# EAGLE design STM_Central_Circuit (EAGLE 6.5.0)
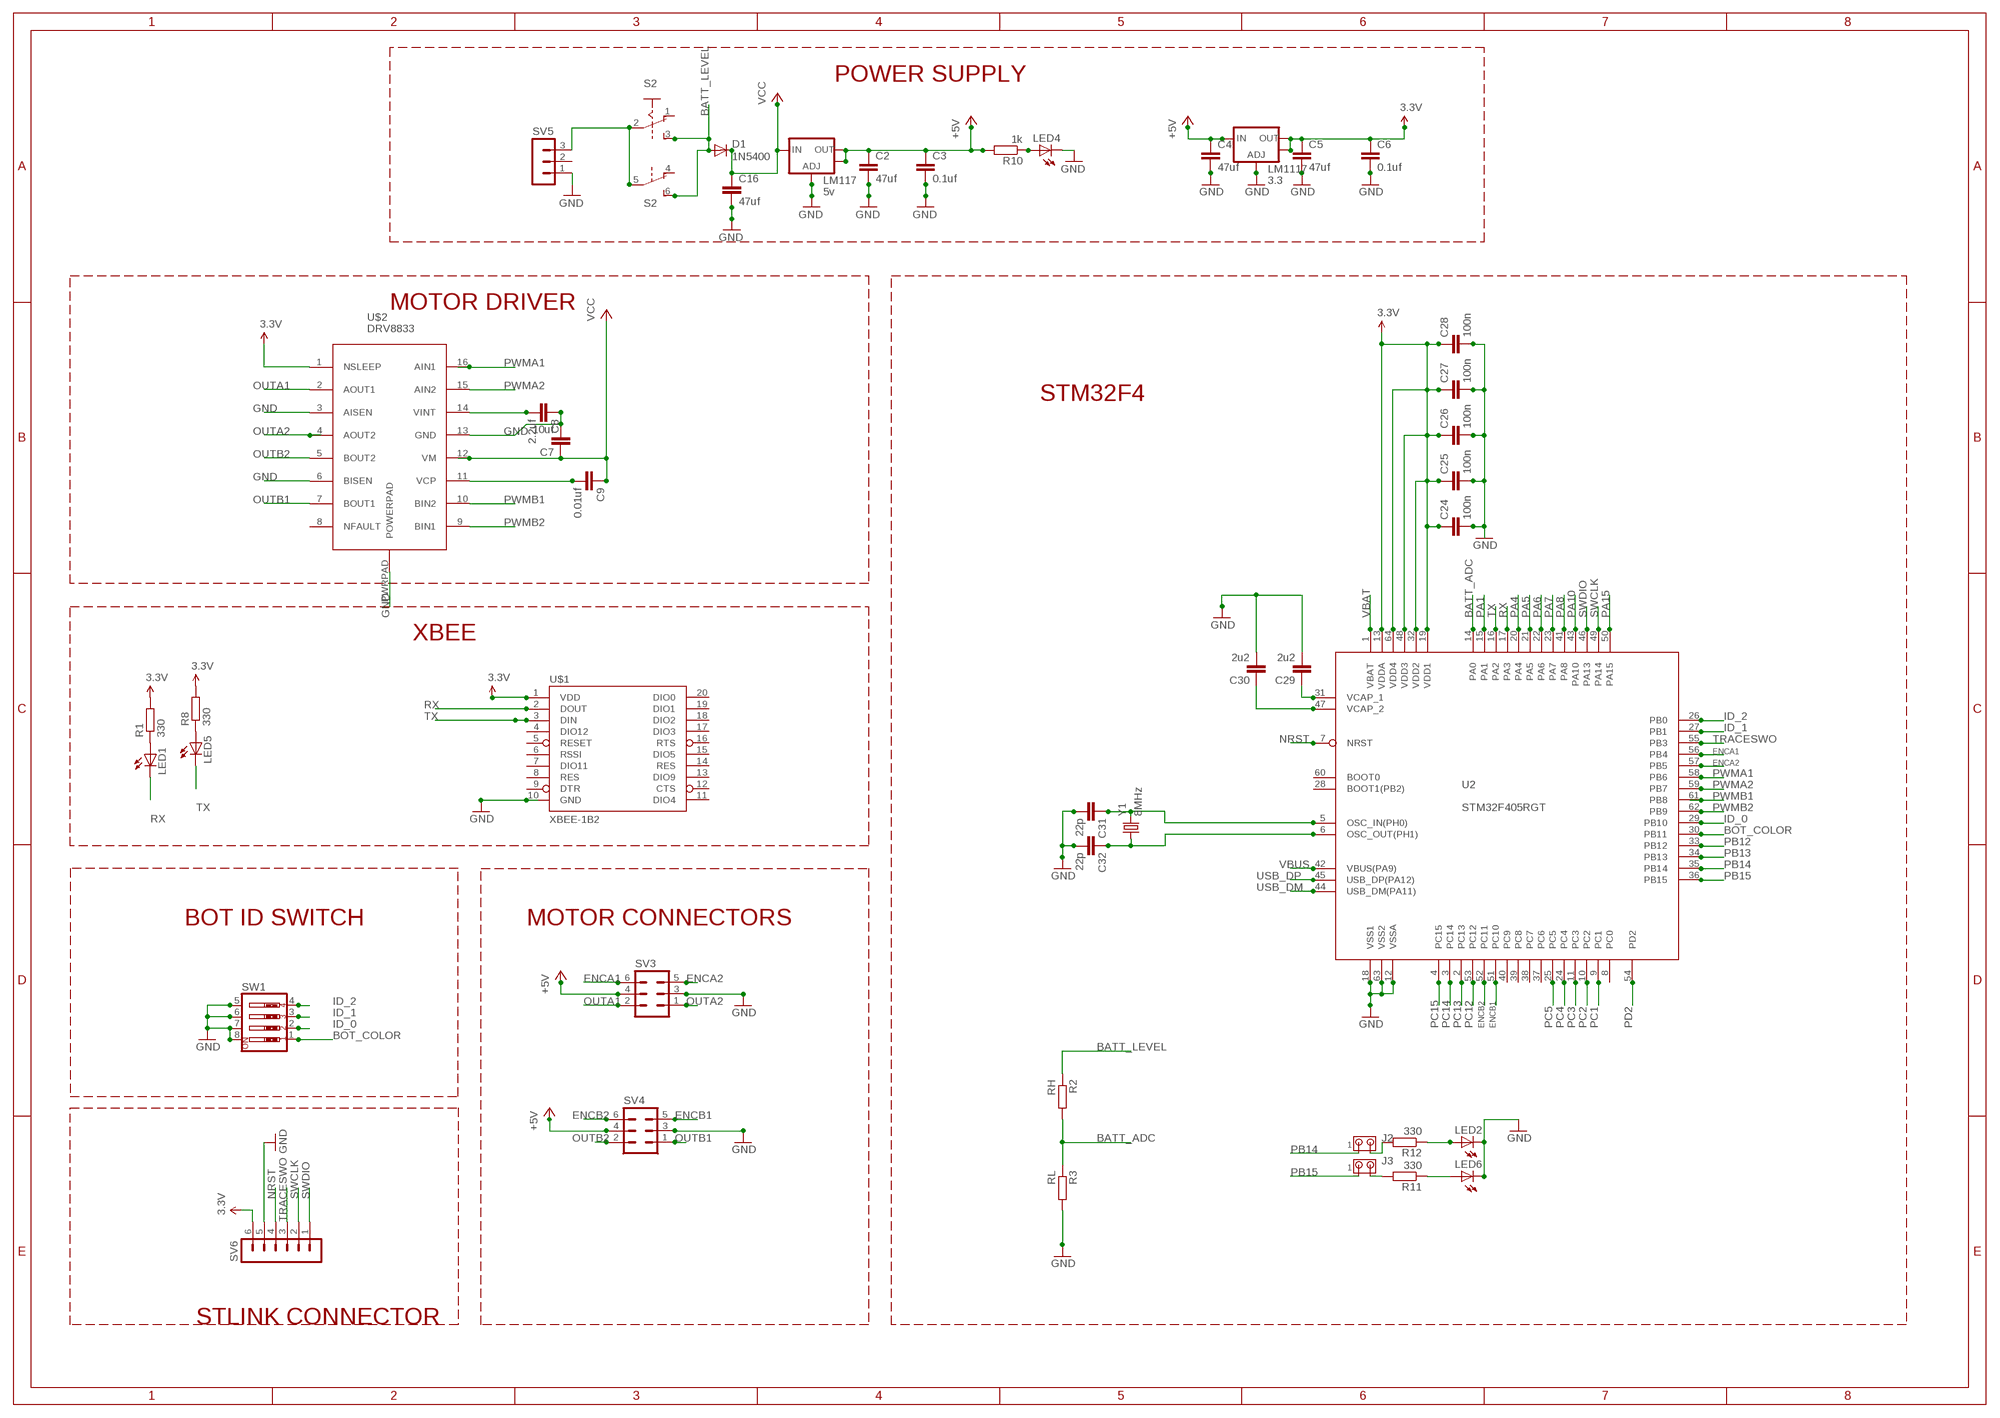
[diagram p0: schematic, sheet 1]

## Parts
C2  47uf  C-EUC1206  [C1206]
C3  0.1uf  C-EUC1206  [C1206]
C4  47uf  C-EUC1206  [C1206]
C5  47uf  C-EUC1206  [C1206]
C6  0.1uf  C-EUC1206  [C1206]
C7  10uf  C-EUC1206  [C1206]
C8  2.2uf  C-EUC1206  [C1206]
C9  0.01uf  C-EUC1206  [C1206]
C16  47uf  C-EUC1206  [C1206]
C24  100n  CAP0603-CAP  [0603-CAP]
C25  100n  CAP0603-CAP  [0603-CAP]
C26  100n  CAP0603-CAP  [0603-CAP]
C27  100n  CAP0603-CAP  [0603-CAP]
C28  100n  CAP0603-CAP  [0603-CAP]
C29  2u2  CAP0603-CAP  [0603-CAP]
C30  2u2  CAP0603-CAP  [0603-CAP]
C31  22p  CAP0603-CAP  [0603-CAP]
C32  22p  CAP0603-CAP  [0603-CAP]
D1  1N5400  [DO201-15]
J2  MTA02-100  [10X02MTA]
J3  MTA02-100  [10X02MTA]
LED1  LED5MM  [LED5MM]
LED2  LED5MM  [LED5MM]
LED4  LED5MM  [LED5MM]
LED5  LED5MM  [LED5MM]
LED6  LED5MM  [LED5MM]
LM117  5v  V_REG_LM1117SOT223  [SOT223]
LM1117  3.3  V_REG_LM1117SOT223  [SOT223]
R1  330  R-EU_0207/10  [0207/10]
R2  RH  R-EU_0207/10  [0207/10]
R3  RL  R-EU_0207/10  [0207/10]
R8  330  R-EU_0207/10  [0207/10]
R10  1k  R-EU_0207/10  [0207/10]
R11  330  R-EU_0207/10  [0207/10]
R12  330  R-EU_0207/10  [0207/10]
S2  A68-A31  [A68-A31]
SV3  MA03-2  [MA03-2]
SV4  MA03-2  [MA03-2]
SV5  MA03-1  [MA03-1]
SV6  MA06-1  [MA06-1]
SW1  SW_DIP-4  [EDG-04]
U2  STM32F405RGT  [LQFP64]
U$1  XBEE-1B2  [XBEE-SILK]
U$2  DRV8833  [PWP_R_PDSO_G16]
Y1  8MHz  CRYSTAL5X3  [CRYSTAL-SMD-5X3]

## Nets
3.3V: C5.1 C6.1 C24.1 C25.1 C26.1 C27.1 C28.1 LM1117.2(OUT) LM1117.4(OUT) R1.2 R8.2 SV6.6 U2.13(VDDA) U2.19(VDD1) U2.32(VDD2) U2.48(VDD3) U2.64(VDD4) U$1.1(VDD) U$2.1(NSLEEP)
+5V: C2.1 C3.1 C4.1 LM117.2(OUT) LM117.4(OUT) LM1117.3(IN) R10.2 SV3.4 SV4.4
BATT_ADC: R2.2 R3.1 U2.14(PA0)
BATT_LEVEL: D1.A R2.1 S2.3(A:S) S2.6(B:S)
BOT_COLOR: SW1.1 U2.30(PB11)
ENCA1: SV3.6 U2.56(PB4)
ENCA2: SV3.5 U2.57(PB5)
ENCB1: SV4.5 U2.51(PC10)
ENCB2: SV4.6 U2.52(PC11)
GND: C2.2 C3.2 C4.2 C5.2 C6.2 C7.2 C8.1 C16.2 C24.2 C25.2 C26.2 C27.2 C28.2 C29.2 C30.2 C31.2 C32.2 LED2.K(C) LED4.K(C) LED6.K(C) LM117.1(ADJ) LM1117.1(ADJ) R3.2 SV3.3 SV4.3 SV5.1 SV6.5 SW1.5 SW1.6 SW1.7 SW1.8 U2.12(VSSA) U2.18(VSS1) U2.63(VSS2) U$1.10(GND) U$2.3(AISEN) U$2.6(BISEN) U$2.13(GND) U$2.PWRPAD(POWERPAD)
ID_0: SW1.2 U2.29(PB10)
ID_1: SW1.3 U2.27(PB1)
ID_2: SW1.4 U2.26(PB0)
N$1: LED1.A R1.1
N$2: LED6.A R11.1
N$3: J2.2 R12.2
N$4: LED4.A R10.1
N$6: LED5.A R8.1
N$7: C8.2 U$2.14(VINT)
N$8: J3.2 R11.2
N$9: LED2.A R12.1
N$10: S2.2(A:P) S2.5(B:P) SV5.3
N$11: C9.2 U$2.11(VCP)
N$13: C29.1 U2.31(VCAP_1)
N$14: C30.1 U2.47(VCAP_2)
N$19: C32.1 U2.6(OSC_OUT(PH1)) Y1.1
N$24: C31.1 U2.5(OSC_IN(PH0)) Y1.3
NRST: SV6.4 U2.7(NRST)
OUTA1: SV3.2 U$2.2(AOUT1)
OUTA2: SV3.1 U$2.4(AOUT2)
OUTB1: SV4.1 U$2.7(BOUT1)
OUTB2: SV4.2 U$2.5(BOUT2)
PA1: U2.15(PA1)
PA4: U2.20(PA4)
PA5: U2.21(PA5)
PA6: U2.22(PA6)
PA7: U2.23(PA7)
PA8: U2.41(PA8)
PA10: U2.43(PA10)
PA15: U2.50(PA15)
PB12: U2.33(PB12)
PB13: U2.34(PB13)
PB14: J2.1 U2.35(PB14)
PB15: J3.1 U2.36(PB15)
PC1: U2.9(PC1)
PC2: U2.10(PC2)
PC3: U2.11(PC3)
PC4: U2.24(PC4)
PC5: U2.25(PC5)
PC12: U2.53(PC12)
PC13: U2.2(PC13)
PC14: U2.3(PC14)
PC15: U2.4(PC15)
PD2: U2.54(PD2)
PWMA1: U2.58(PB6) U$2.16(AIN1)
PWMA2: U2.59(PB7) U$2.15(AIN2)
PWMB1: U2.61(PB8) U$2.10(BIN2)
PWMB2: U2.62(PB9) U$2.9(BIN1)
RX: LED1.K(C) U2.17(PA3) U$1.2(DOUT)
SWCLK: SV6.2 U2.49(PA14)
SWDIO: SV6.1 U2.46(PA13)
TRACESWO: SV6.3 U2.55(PB3)
TX: LED5.K(C) U2.16(PA2) U$1.3(DIN)
USB_DM: U2.44(USB_DM(PA11))
USB_DP: U2.45(USB_DP(PA12))
VBAT: U2.1(VBAT)
VBUS: U2.42(VBUS(PA9))
VCC: C7.1 C9.1 C16.1 D1.C LM117.3(IN) U$2.12(VM)
Unconnected: S2.1(A:O) S2.4(B:O) SV5.2 U2.8(PC0) U2.28(BOOT1(PB2)) U2.37(PC6) U2.38(PC7) U2.39(PC8) U2.40(PC9) U2.60(BOOT0) U$1.4(DIO12) U$1.5(RESET) U$1.6(RSSI) U$1.7(DIO11) U$1.8(RES) U$1.9(DTR) U$1.11(DIO4) U$1.12(CTS) U$1.13(DIO9) U$1.14(RES) U$1.15(DIO5) U$1.16(RTS) U$1.17(DIO3) U$1.18(DIO2) U$1.19(DIO1) U$1.20(DIO0) U$2.8(NFAULT)

## Notes on the sheet
- POWER SUPPLY
- MOTOR DRIVER
- STM32F4
- XBEE
- BOT ID SWITCH | MOTOR CONNECTORS
- STLINK CONNECTOR

## Library data of the parts
C2-C9 C16 = rcl:C-EU: CAPACITOR, European symbol
C24-C32 = stm32f4stamp:CAP: Capacitor Standard 0603 ceramic capacitor, and 0.1" leaded capacitor.
D1 = diode:1N5400: DIODE standard rectifier, 3 A, 50 V (Motorola)
J2 J3 = con-amp:MTA02-100: AMP connector; OC_FARNELL: unknown; OC_NEWARK: unknown
LED1 LED2 LED4-LED6 = SparkFun:LED: LEDs Standard schematic elements and footprints for 5mm, 3mm, 1206, and 0603 sized LEDs. 5mm - Spark Fun Electronics SKU : COM-00529 (and others)
LM117 LM1117 = SparkFun:V_REG_LM1117: Voltage Regulator LM1117 Standard adjustable voltage regulator but in SMD form. Spark Fun Electronics SKU : COM-00595
R1-R3 R8 R10-R12 = rcl:R-EU_: RESISTOR, European symbol
S2 = switch:A68-A31: SLIDING SWITCH Siemens, distributor Buerklin, 11G766
SV3 SV4 = con-lstb:MA03-2: PIN HEADER; OC_FARNELL: unknown; OC_NEWARK: unknown
SV5 = con-lstb:MA03-1: PIN HEADER; OC_FARNELL: unknown; OC_NEWARK: unknown
SV6 = con-lstb:MA06-1: PIN HEADER; OC_FARNELL: unknown; OC_NEWARK: unknown
SW1 = special:SW_DIP-4: DIP SWITCH
U2 = stm32f4stamp:STM32F405RGT
U$1 = SparkFun:XBEE-1
U$2 = drv8833:DRV8833
Y1 = stm32f4stamp:CRYSTAL: Crystals Various standard crystals. Proven footprints. Spark Fun Electronics SKU : COM-00534

## Net classes
1 pwr: width 0.25 mm

## Board
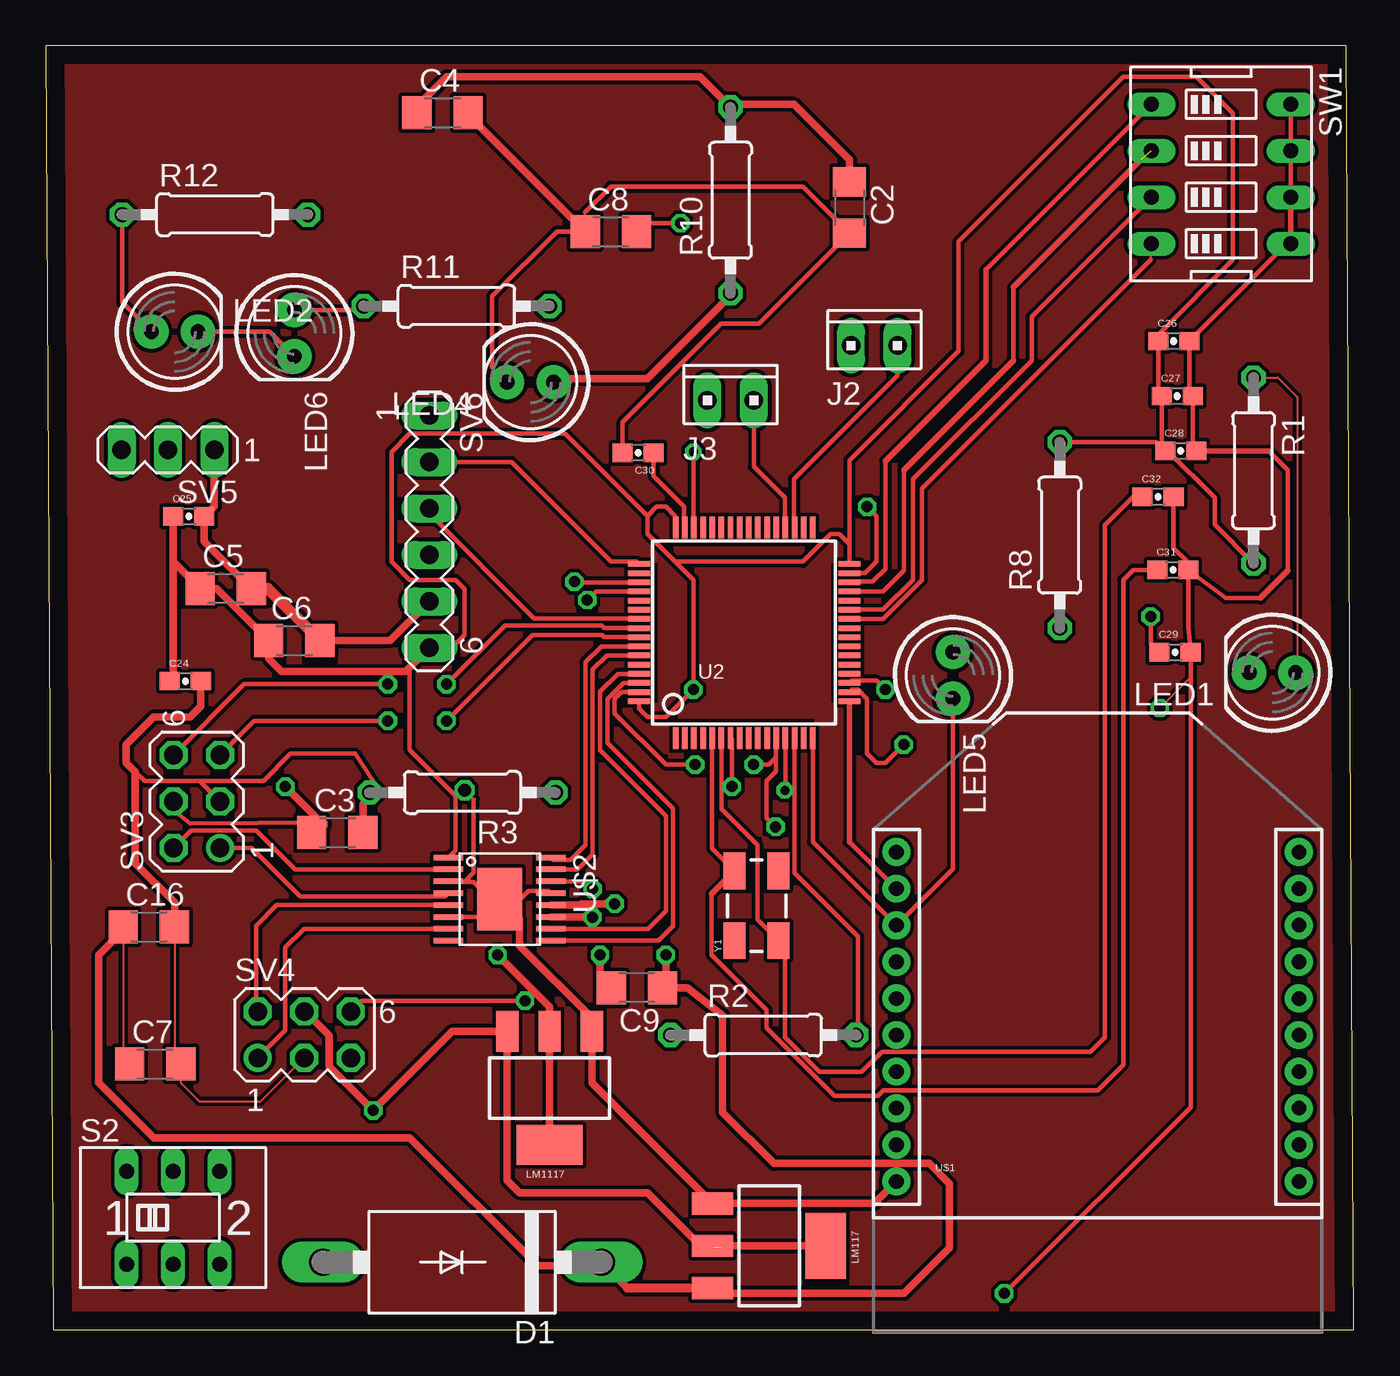
[diagram p1: board, top side]
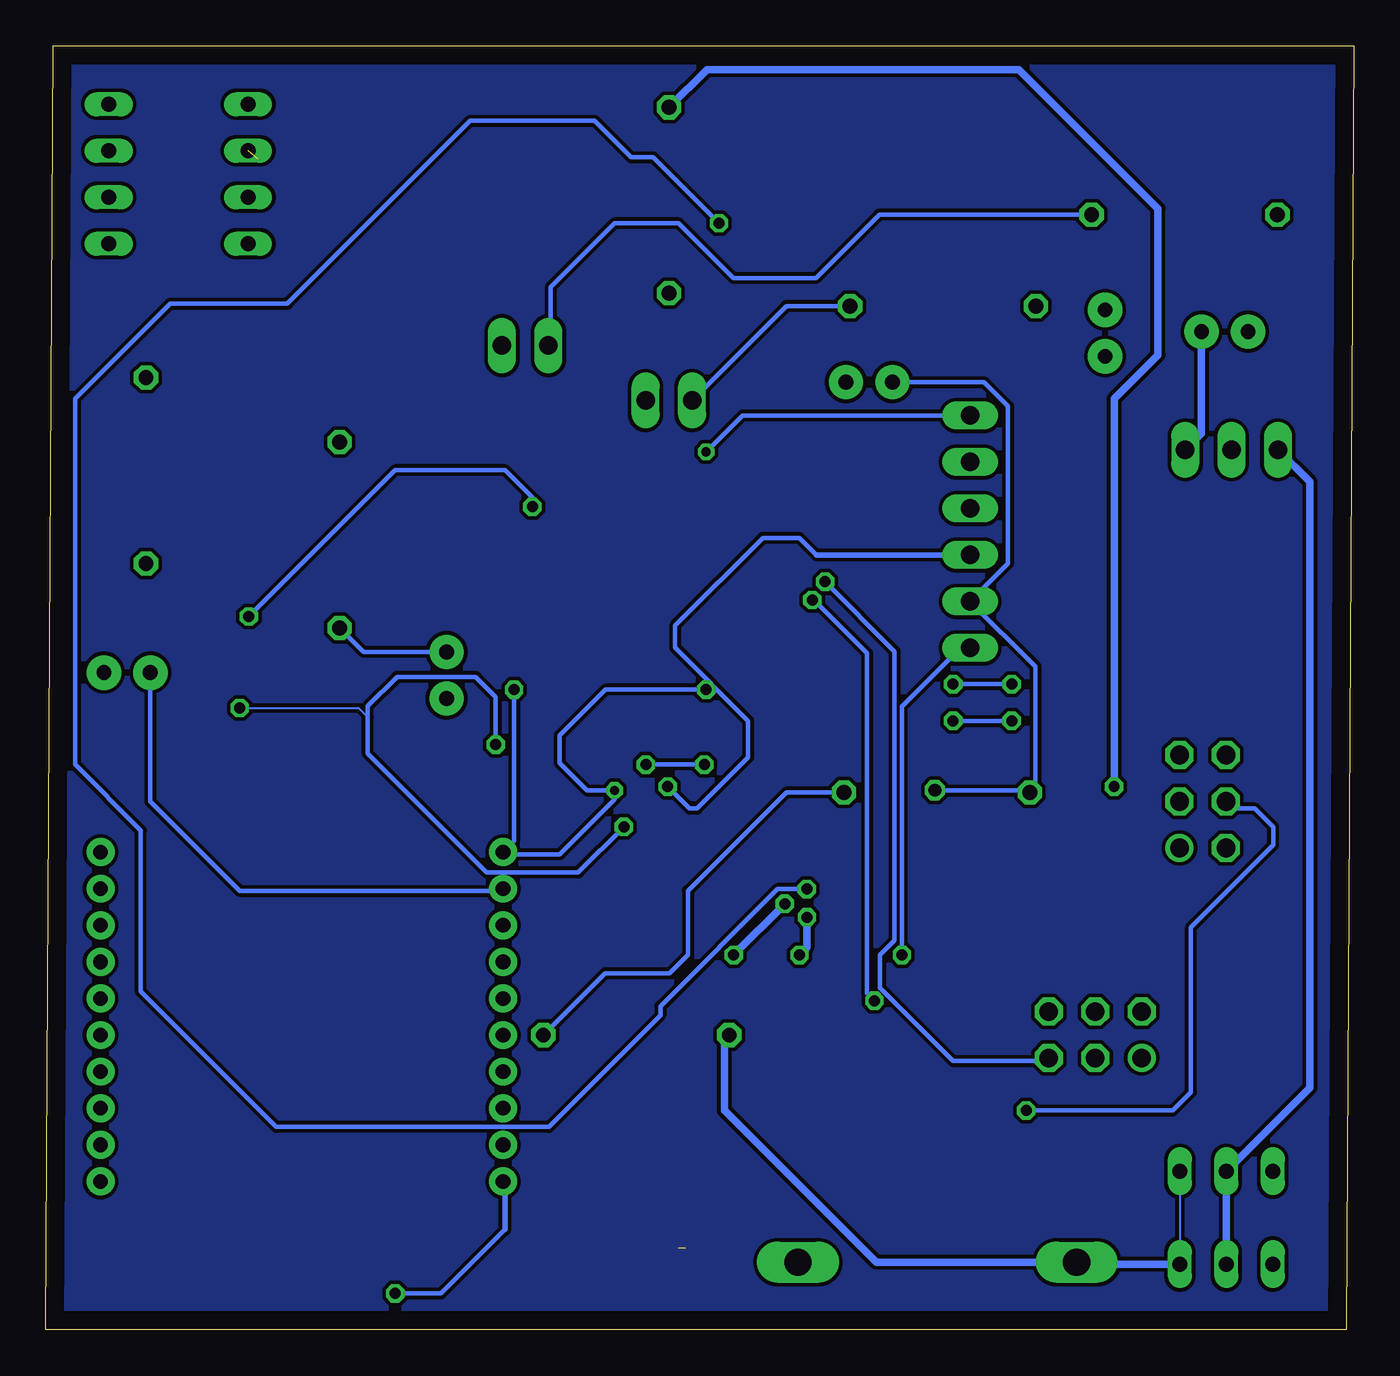
[diagram p2: board, bottom side, seen from below]

Size 71.5 x 70.2 mm. Coordinates in mm from the lower left corner, seen from the top.
Outline: 0.4,0 71.5,0 71.1,70.2 0,70.2 0.4,0
Copper layers (1*16): Top 0.035mm / dielectric 1.5mm / Bottom 0.035mm
Design rules "default": minimum track width 10mil, minimum drill 24mil, track to track 8mil, track to pad 8mil, pad to pad 8mil, via to via 8mil, smd to smd 8mil, copper to edge 40mil, drill to drill 8mil, minimum pad ring 10mil, minimum via ring 8mil, stop-mask expansion 4mil, vias tented up to drill 0mil, thermal gap 10mil

### Footprints (pad centres in the part's own frame; a part is rotated, then mirrored left to right if it is on the bottom)
C1206 = smd 1.6 x 1.8: 1 -1.4,0; 2 1.4,0
0603-CAP = smd 1.1 x 1: 1 -0.85,0; 2 0.85,0
DO201-15 = drill 1.499 long: A 7.62,0; C -7.62,0
10X02MTA = drill 1.016 long: 1 1.27,0; 2 -1.27,0
LED5MM = drill 0.813 pad 1.88: A -1.27,0; K 1.27,0
SOT223 = smd 1.219 x 2.235: 1 -2.311,-3.099; 2 0,-3.099; 3 2.311,-3.099 | smd 3.6 x 2.2: 4 0,3.099
0207/10 = drill 0.813 octagon: 1 -5.08,0; 2 5.08,0
A68-A31 = drill 0.813 long: 1 -2.54,-2.54; 2 0,-2.54; 3 2.54,-2.54; 4 -2.54,2.54; 5 0,2.54; 6 2.54,2.54
MA03-2 = drill 1.016: 1 -2.54,-1.27 | drill 1.016 octagon: 2 -2.54,1.27; 3 0,-1.27; 4 0,1.27; 5 2.54,-1.27; 6 2.54,1.27
MA03-1 = drill 1.016 long: 1 -2.54,0; 2 0,0; 3 2.54,0
MA06-1 = drill 1.016 long: 1 -6.35,0; 2 -3.81,0; 3 -1.27,0; 4 1.27,0; 5 3.81,0; 6 6.35,0
EDG-04 = drill 0.813 long: 1 -3.81,-3.81; 2 -1.27,-3.81; 3 1.27,-3.81; 4 3.81,-3.81; 5 3.81,3.81; 6 1.27,3.81; 7 -1.27,3.81; 8 -3.81,3.81
LQFP64 = smd 0.3 x 1.2: 1 -3.75,-5.75; 2 -3.25,-5.75; 3 -2.75,-5.75; 4 -2.25,-5.75; 5 -1.75,-5.75; 6 -1.25,-5.75; 7 -0.75,-5.75; 8 -0.25,-5.75; 9 0.25,-5.75; 10 0.75,-5.75; 11 1.25,-5.75; 12 1.75,-5.75; 13 2.25,-5.75; 14 2.75,-5.75; 15 3.25,-5.75; 16 3.75,-5.75; 33 3.75,5.75; 34 3.25,5.75; 35 2.75,5.75; 36 2.25,5.75; 37 1.75,5.75; 38 1.25,5.75; 39 0.75,5.75; 40 0.25,5.75; 41 -0.25,5.75; 42 -0.75,5.75; 43 -1.25,5.75; 44 -1.75,5.75; 45 -2.25,5.75; 46 -2.75,5.75; 47 -3.25,5.75; 48 -3.75,5.75 | smd 1.2 x 0.3: 17 5.75,-3.75; 18 5.75,-3.25; 19 5.75,-2.75; 20 5.75,-2.25; 21 5.75,-1.75; 22 5.75,-1.25; 23 5.75,-0.75; 24 5.75,-0.25; 25 5.75,0.25; 26 5.75,0.75; 27 5.75,1.25; 28 5.75,1.75; 29 5.75,2.25; 30 5.75,2.75; 31 5.75,3.25; 32 5.75,3.75; 49 -5.75,3.75; 50 -5.75,3.25; 51 -5.75,2.75; 52 -5.75,2.25; 53 -5.75,1.75; 54 -5.75,1.25; 55 -5.75,0.75; 56 -5.75,0.25; 57 -5.75,-0.25; 58 -5.75,-0.75; 59 -5.75,-1.25; 60 -5.75,-1.75; 61 -5.75,-2.25; 62 -5.75,-2.75; 63 -5.75,-3.25; 64 -5.75,-3.75
XBEE-SILK = drill 0.8 pad 1.524: 1 -11,20; 2 -11,18; 3 -11,16; 4 -11,14; 5 -11,12; 6 -11,10; 7 -11,8; 8 -11,6; 9 -11,4; 10 -11,2; 11 11,2; 12 11,4; 13 11,6; 14 11,8; 15 11,10; 16 11,12; 17 11,14; 18 11,16; 19 11,18; 20 11,20
PWP_R_PDSO_G16 = smd 0.3 x 1.6: 1 -2.275,-2.8; 2 -1.625,-2.8; 3 -0.975,-2.8; 4 -0.325,-2.8; 5 0.325,-2.8; 6 0.975,-2.8; 7 1.625,-2.8; 8 2.275,-2.8; 9 2.275,2.8; 10 1.625,2.8; 11 0.975,2.8; 12 0.325,2.8; 13 -0.325,2.8; 14 -0.975,2.8; 15 -1.625,2.8; 16 -2.275,2.8 | smd 3.4 x 2.46: PWRPAD 0,0
CRYSTAL-SMD-5X3 = smd 2 x 1.2: 1 -1.9,-1.2; 2 1.9,-1.2; 3 1.9,1.2; 4 -1.9,1.2

### Placement (x,y rotation side)
C2  43.94,61.36 270 top
C3  15.94,27.19 0 top
C4  21.69,66.54 0 top
C5  9.84,40.54 0 top
C6  13.59,37.69 0 top
C7  5.99,14.54 0 top
C8  30.89,60.04 0 top
C9  32.31,18.71 180 top
C16  5.64,22.04 0 top
C24  7.63,35.47 0 top
C25  7.82,44.47 0 top
C26  61.66,54.05 0 top
C27  61.85,51.05 0 top
C28  62.04,48.05 0 top
C29  61.73,37.05 0 top
C30  32.38,47.95 180 top
C31  61.61,41.55 0 top
C32  60.8,45.55 0 top
D1  22.76,3.7 180 top
J2  45.29,53.81 0 top
J3  37.44,50.81 0 top
LED1  67.05,35.93 180 top
LED2  7.05,54.57 0 top
LED4  26.49,51.81 180 top
LED5  49.59,35.79 270 top
LED6  13.59,54.49 270 top
LM117  39.54,4.6 270 top
LM1117  27.54,13.22 180 top
R1  66.02,46.98 270 top
R2  39.22,16.12 0 top
R3  22.78,29.38 180 top
R8  55.43,43.45 90 top
R10  37.43,61.75 90 top
R11  22.45,55.97 0 top
R12  9.25,60.97 0 top
S2  6.96,6.14 0 top
SV3  8.26,28.89 90 top
SV4  14.13,16.14 0 top
SV5  6.68,48.11 180 top
SV6  20.97,43.64 270 top
SW1  64.25,63.19 270 top
U2  38.18,38.12 0 top
U$1  57.5,6.12 0 top
U$2  24.81,23.55 270 top
Y1  38.86,23.19 90 top

### Tracks (layer width: path | path; a pad name or v marks a point on that pad's centre or on a via)
3.3V  (via drill 0.5 pad 0.2, 0.6 pad 0.2)
  Top 0.1: 60.81,51.24 C27.1 | 61,48.24 C28.1 61.35,48.05 | C25.1 6.97,42.01 | 6.97,35.66 C24.1 | C6.1 12.19,36.71 | 60.9,54.14 C26.1 | 40.43,29.53 v40.4,29.5 | 34.4,43.9 U2.48
  Top 0.254: C26.1 60.81,51.24 | C27.1 61,48.24 | R8.2 60.71,48.53 C28.1 | 61.35,48.05 63.9,45.5 63.9,44.02 R1.2 | 60.9,54.14 60.9,54.5 64.9,58.5 64.9,66.5 62.9,68.5 58.9,68.5 49.9,59.5 49.9,53.5 43.93,47.53 U2.32 43.93,42.97 43.4,43.5 42.9,43.5 41.4,42 34.4,42 | U2.13 40.43,29.53 | 34.4,42 32.9,43.5 32.9,44.5 | 32.9,44.5 33.4,45 33.9,45 34.4,44.5 34.4,43.9 | SV6.6 22.19,37.29 22.9,38 22.9,40.5 22.4,41 19.9,41 18.9,42 18.9,48 19.9,49 28.4,49 32.9,44.5 | U2.64 32.43,33.97 32.9,33.5 33.9,33.5 v35.4,35 35.4,41 34.4,42 | v45.9,35 45.4,35.5 44.06,35.5 U2.19 | U$2.1 22.4,26.21 22.4,29.2 19.9,31.7 19.9,36.22
  Top 0.406: 6.97,42.01 C5.1 9.34,40.54 C6.1 | C25.1 6.97,35.66 | 12.19,36.71 12.9,36 19.68,36 19.9,36.22 SV6.6 | LM1117.4 LM1117.2 27.54,17.66 v24.7,20.5
  Bottom 0.1: 46.38,26 U$1.1 | 21.5,37.29 SV6.6
  Bottom 0.254: 46.38,26 43.4,26 40.4,29 v40.4,29.5 41.9,29.5 43.4,31 43.4,32.5 40.9,35 v35.4,35 | v45.9,35 45.9,26.72 U$1.1 | v24.7,20.5 24.7,34.09 21.5,37.29
+5V  (via drill 0.6 pad 0.2, 0.6 pad 0.81)  (1 unrouted)
  Top 0.1: C4.1 20.29,66.89 | 37.6,67 R10.2 | SV4.4 14.19,17.41
  Top 0.254: SV3.4 6.99,28.41 7.9,27.7 15.3,27.73 | 15.3,27.73 C3.1 | 15.3,27.73 15.23,27.57
  Top 0.406: LM117.4 LM117.2 36.54,4.5 | 20.29,66.89 21.9,68.5 35.76,68.5 R10.2 | C2.1 43.94,63.96 40.9,67 37.6,67 | 14.19,17.41 15.5,16.1 15.5,14.4 v17.9,12 22.22,16.32 LM1117.3 25.23,8.17 25.9,7.5 32.9,7.5 35.9,4.5 36.9,4.5 | 15.23,27.57 v13.1,29.7
  Bottom 0.254: v17.9,12 9.9,12 8.9,13 8.9,22 4.4,26.5 4.4,27.5 5.4,28.5 6.6,28.5 SV3.4
  Bottom 0.406: v13.1,29.7 13.1,50.9 10.7,53.3 10.7,61.3 18.3,68.9 35.36,68.9 R10.2
BATT_ADC
  Top 0.1: 44.4,16.22 R2.2
  Top 0.254: U2.14 40.93,24.97 44.4,21.5 44.4,16.22
  Bottom 0.254: R3.1 31.02,29.38 36.4,24 36.4,20.5 37.4,19.5 40.92,19.5 R2.2
BATT_LEVEL
  Bottom 0.1: S2.6 S2.3 | 15.04,3.6 D1.A | 34.4,15.86 R2.1
  Bottom 0.406: S2.3 15.04,3.6 | D1.A 26.1,3.7 34.4,12 34.4,15.86
BOT_COLOR
  Top 0.254: 51.4,57.96 SW1.1 | 45.9,47.5 45.9,41.6 45.2,40.9 43.96,40.9 U2.30
  Top 0.305: 45.9,47.5 51.4,53 51.4,57.96
ENCA1  (via drill 0.6 pad 0.2)
  Top 0.254: U2.56 30.53,38.37 30.4,38.5 25.1,38.5 v21.9,35.3 | v18.7,35.3 10.86,35.3 SV3.6
  Bottom 0.254: v21.9,35.3 v18.7,35.3
ENCA2  (via drill 0.6 pad 0.2)
  Top 0.254: U2.57 30.53,37.87 30.4,38 26.6,38 v21.9,33.3 | v18.7,33.3 11.4,33.3 SV3.5
  Bottom 0.254: v21.9,33.3 v18.7,33.3
ENCB1  (via drill 0.6 pad 0.2)
  Top 0.1: 28.93,40.87 v28.9,40.9
  Top 0.254: U2.51 28.93,40.87
  Bottom 0.1: 16.84,14.7 SV4.5
  Bottom 0.254: v28.9,40.9 25.1,37.1 25.1,21.3 25.9,20.5 25.9,18.7 21.9,14.7 16.84,14.7
ENCB2  (via drill 0.6 pad 0.2)
  Top 0.254: U2.52 30.07,40.37 v29.6,39.9 | v26.2,18 17.26,18 SV4.6
  Bottom 0.1: v29.6,39.9 29.5,39.9 | 26.6,18.4 v26.2,18
  Bottom 0.254: 29.5,39.9 26.6,37 26.6,18.4
GND  (via drill 0.6 pad 0.2, 0.7 pad 0.41)
  Top 0.1: 62.51,51.24 C27.2 | 62.7,48.24 C28.2 | C4.2 23.09,66.44 | C8.1 29.49,61.09 | C16.2 7.04,14.89 C7.2 7.39,13.51 8.4,12.5 11.76,12.5 SV4.3 | 24.4,52.63 LED4.K | 27.48,24 U$2.13 | U$2.PWRPAD 24.35,23.55 | 22.04,24.5 U$2.3 22.92,24.52 | 62.4,42 62.4,41.61 C31.2 | 17.9,30 17.82,30 | 44.06,35 U2.18 | LM1117.1 29.85,17.05 | 23.4,29 v22.9,29.5 | C29.2 62.58,35.68 v60.9,34
  Top 0.254: 62.51,51.24 C26.2 67.84,59.38 SW1.5 | C27.2 62.7,48.24 | SW1.8 SW1.7 SW1.6 | LED2.K 12.24,54.57 LED6.K | 29.49,61.09 30.9,62.5 41.4,62.5 C2.2 38.98,55 36.9,55 31.53,49.63 C30.2 | 66.85,48.05 67.9,47 67.9,41.5 | 66.4,40 64.51,40 C31.2 62.46,38.43 C29.2 62.58,12.18 v52.4,2 | C8.1 27.94,60.04 24.4,56.5 24.4,52.63 | 27.48,24 26.4,24 25.95,23.55 U$2.PWRPAD 23.83,22.57 U$2.6 | 24.35,23.55 23.4,24.5 22.04,24.5 | C32.2 61.65,42.75 62.4,42 | 4.9,30.5 5.4,30 8.42,30 | 8.42,30 SV3.3 | 8.42,30 11.9,30 13.4,31.5 16.9,31.5 17.9,30 | 17.82,30 R3.2 | U2.12 39.93,31.3 | 39.93,31.3 39.93,30.53 39.4,30 39.4,28 v39.9,27.5 | v46.9,32 45.9,31 45.4,31 44.9,31.5 44.9,34.5 44.4,35 44.06,35 | 22.92,24.52 23.4,25 23.4,29 | U2.63 31.47,34.87 31.1,34.5 31.1,33.7 33.9,30.9 v35.5,30.9 | v38.7,30.9 39.53,30.9 39.93,31.3
  Top 0.305: SW1.6 SW1.5 | C28.2 66.85,48.05 | 67.9,41.5 66.4,40
  Top 0.406: 12.14,40.54 C5.2 8.67,43.11 C25.2 9.22,45.02 SV5.1 | C6.2 18.83,37.69 SV6.5 | 23.09,66.44 C8.1 | LM1117.1 29.85,13.5 LM117.1 45.29,6.91 U$1.10 | C3.2 17.34,28.74 R3.2 | C16.2 7.04,23.36 4.9,25.5 4.9,30.5 4.4,31 4.4,32 5.9,33.5 7.9,33.5 8.48,34.08 C24.2 | 29.85,17.05 25.9,21 25.9,22.46 U$2.PWRPAD
  Top 0.61: 12.14,40.54 C6.2
  Bottom 0.1: 46.4,8.02 U$1.10 | 17.82,29.5 R3.2 | v60.9,34 54.4,34 53.9,33.5
  Bottom 0.254: R3.2 17.4,29.68 17.4,36.26 SV6.5 18.9,41.9 18.9,50.5 20.21,51.81 LED4.K | v52.4,2 49.9,2 46.4,5.5 | v39.9,27.5 42.4,25 47.4,25 53.9,31.5 53.9,33.5 53.9,34.1 52.3,35.7 48,35.7 46.9,34.6 46.9,34.5 v46.9,32 | v22.9,29.5 17.82,29.5 | v35.5,30.9 v38.7,30.9
  Bottom 0.305: 46.4,5.5 46.4,8.02
  Bottom 0.406: LED2.K 8.32,49.01 SV5.1
ID_0  (1 unrouted)
  Top 0.254: U2.29 45.77,40.37 46.9,41.5 46.9,47 | 52.9,53 52.9,57
  Top 0.305: 46.9,47 52.9,53 | 52.9,57 59.9,64
ID_1
  Top 0.254: U2.27 45.77,39.37 47.4,41 47.4,46.5 53.9,53 53.9,55.38 SW1.3
ID_2
  Top 0.1: 60.4,58.5 60.4,59.34 SW1.4
  Top 0.254: U2.26 45.77,38.87 47.9,41 47.9,46 60.4,58.5
N$1
  Top 0.1: R1.1 67.34,52.06 68.4,51 68.4,36.51 LED1.A
N$2
  Top 0.254: LED6.A 17.16,55.76 R11.1
N$3
  Bottom 0.1: 43.9,53.93 J2.2
  Bottom 0.254: R12.2 25.93,60.97 29.4,57.5 33.9,57.5 36.9,60.5 40.4,60.5 43.9,57 43.9,53.93
N$4
  Top 0.1: R10.1 37.43,56.53
  Top 0.406: 37.43,56.53 32.9,52 27.95,52 LED4.A
N$5
  pour Bottom: -0.1,70.5 -0.1,-0.5 71.9,-0.5 71.9,70.5
N$6
  Bottom 0.254: LED5.A 54.12,37.06 R8.1
N$7  (via drill 0.6 pad 0.2)
  Top 0.1: 32.75,60.5 C8.2
  Top 0.254: U$2.14 29.47,24.52 v29.9,24.1 | v34.7,60.5 32.75,60.5
  Bottom 0.254: v29.9,24.1 31.5,24.1 37.9,17.7 37.9,17.2 44,11.1 58.9,11.1 66.3,18.5 66.3,27.3 69.9,30.9 69.9,50.9 64.7,56.1 58.3,56.1 48.3,66.1 41.5,66.1 39.5,64.1 38.3,64.1 v34.7,60.5
N$8
  Bottom 0.254: R11.2 31.01,55.97 J3.2
N$9
  Top 0.254: R12.1 4.17,56.18 LED2.A
N$10
  Bottom 0.406: SV5.3 2.4,46.37 2.4,13.24 S2.5 S2.2
N$11  (via drill 0.6 pad 0.2)
  Top 0.1: 29.82,22.57 v29.89,22.56 | 30.3,19.32 C9.2
  Top 0.406: U$2.11 29.82,22.57 | v30.3,20.5 30.3,19.32
  Bottom 0.406: v29.89,22.56 29.9,20.9 v30.3,20.5
N$12
  pour Top: -0.1,70.5 -0.1,-0.5 71.9,-0.5 71.9,70.5
N$13  (via drill 0.6 pad 0.2)
  Top 0.1: 60.4,37.53 C29.1
  Top 0.254: U2.31 44.77,41.37 45.4,42 45.4,44.5 v44.9,45 | v60.4,39 60.4,37.53
  Bottom 0.254: v44.9,45 44.9,45.5 46.4,47 52.4,47 v60.4,39
N$14
  Top 0.1: 34.9,43.9 U2.47
  Top 0.254: C30.1 33.23,46.67 34.9,45 34.9,43.9
N$19
  Top 0.1: C32.1 59.45,45.55 | 40.4,20.95 Y1.1
  Top 0.254: U2.6 36.93,28.47 38.9,26.5 38.9,22.45 Y1.1 | 59.45,45.55 57.9,44 57.9,16 57.1,15.2 45.7,15.2 44.6,14.1 42.3,14.1 40.4,16 40.4,20.95
N$24
  Top 0.254: U2.5 36.43,26.32 Y1.3 | C31.1 59.45,41.55 58.9,41 58.9,14.5 57.5,13.1 45.8,13.1 45.5,12.8 43.1,12.8 39.4,16.5 39.4,17.5 36.4,20.5 36.4,23.83
  Top 0.305: 36.4,23.83 Y1.3
NRST  (via drill 0.6 pad 0.2)
  Top 0.1: 37.5,32.3 U2.7
  Top 0.254: v37.5,29.7 37.5,32.3
  Bottom 0.254: 29.37,42.37 30.3,43.3 32.3,43.3 37.1,38.5 37.1,37.3 33.1,33.3 33.1,31.3 35.9,28.5 36.3,28.5 v37.5,29.7
  Bottom 0.305: SV6.4 29.37,42.37
OUTA1
  Top 0.254: U$2.2 13.62,25.18 11.5,27.3 7.94,27.3 SV3.2
OUTA2
  Top 0.254: SV3.1 11.25,26.35 13.9,23.7 21.83,23.7 U$2.4
OUTB1
  Top 0.254: U$2.7 14.12,21.93 13.1,20.9 13.1,16.38 SV4.1
OUTB2
  Top 0.1: 11.5,17.5 SV4.2
  Top 0.254: U$2.5 12.62,23.23 11.5,22.1 11.5,17.5
PB14
  Top 0.1: 40.9,43.9 U2.35
  Top 0.254: J2.1 46.56,52.16 40.9,46.5 40.9,43.9
PB15
  Top 0.1: 40.4,43.9 U2.36
  Top 0.254: J3.1 38.71,47.19 40.4,45.5 40.4,43.9
PWMA1
  Top 0.1: 27.73,25.7 U$2.16
  Top 0.254: U2.58 30.37,37.37 29.5,36.5 29.5,26.5 28.7,25.7 27.73,25.7
PWMA2
  Top 0.254: U$2.15 29.07,25.18 29.9,26 29.9,36.1 30.67,36.87 U2.59
PWMB1
  Top 0.254: U2.61 31.27,35.87 30.3,34.9 30.3,31.7 33.9,28.1 33.9,22.9 32.92,21.93 U$2.10
PWMB2
  Top 0.1: 27.63,21.3 U$2.9
  Top 0.254: U2.62 31.57,35.37 30.7,34.5 30.7,32.1 34.3,28.5 34.3,22.1 33.5,21.3 27.63,21.3
RX
  Top 0.254: 43.93,26.69 U$1.2
  Top 0.305: U2.17 43.93,26.69
  Bottom 0.1: 46.62,24 U$1.2
  Bottom 0.254: LED1.K 65.78,28.88 60.9,24 46.62,24
SWCLK
  Top 0.254: SV6.2 25.45,47.45 30.9,42 32.3,42 U2.49
SWDIO  (via drill 0.5 pad 0.2)
  Top 0.1: 35.4,43.9 U2.46
  Top 0.254: v35.4,48 35.4,43.9
  Bottom 0.254: SV6.1 33.41,49.99 v35.4,48
TRACESWO
  Top 0.1: SV6.3 20.97,44.63 | 32.4,38.9 U2.55
  Top 0.254: 20.97,44.63 26.7,38.9 32.4,38.9
TX
  Top 0.254: U2.16 41.93,26.69 U$1.3 49.59,25.21 LED5.K
VCC  (via drill 0.6 pad 0.2)
  Top 0.1: 30.58,3.5 D1.C | 36.73,2 LM117.3 | C7.1 4.24,14.89 C16.1 4.24,21.84 | 31.02,23.23 v31.1,23.3 | 33.9,18.9 C9.1
  Top 0.406: 31.79,2.29 30.58,3.5 26.9,3.5 19.9,10.5 5.9,10.5 2.9,13.5 2.9,20.5 4.24,21.84 | C9.1 35.09,18.71 37,17.2 37,11.9 39.8,9.1 48.3,9.1 49.4,8 49.4,4.5 46.9,2 36.73,2 | v33.9,20.5 33.9,18.9 | U$2.12 29.22,23.23 29.3,23.3 v31.1,23.3
  Top 0.5: LM117.3 31.79,2.29
  Bottom 0.406: v31.1,23.3 v33.9,20.5